# Altium schematic sheet sch.SchDoc
size A4
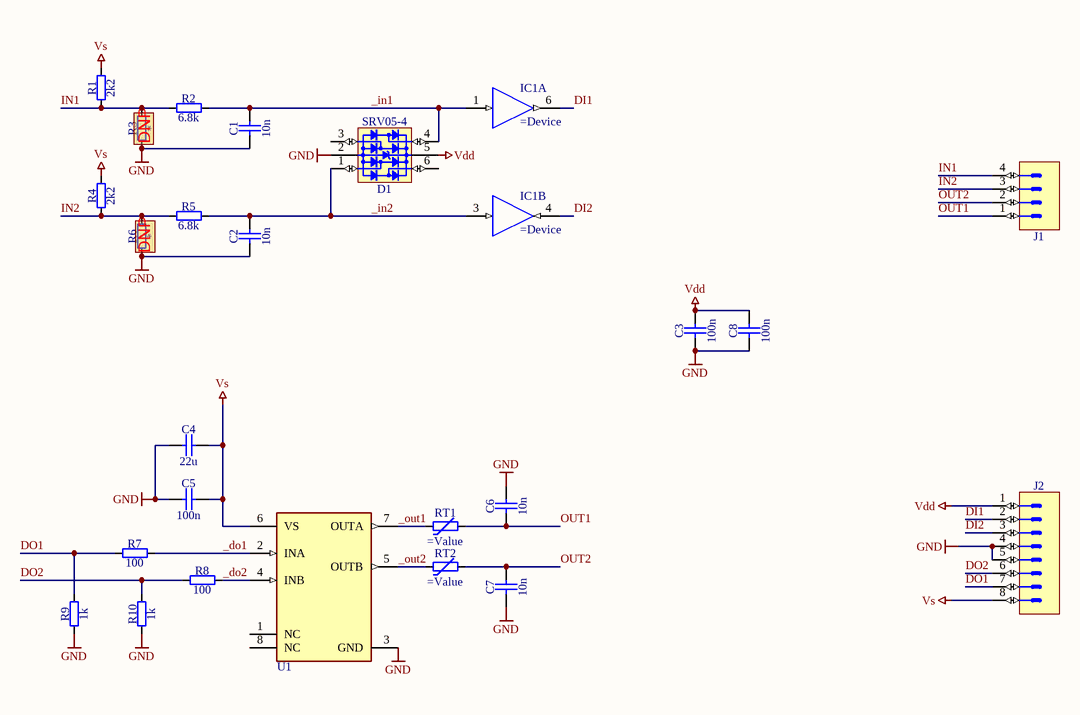
[diagram p0: sch.SchDoc]

## Parts
C1  10n  [CAPC1608X85N]
C2  10n  [CAPC1608X85N]
C3  100n  [CAPC1608X85N]
C4  22u  [CAPC3216X140N]
C5  100n  [CAPC1608X85N]
C6  10n  [CAPC1608X85N]
C7  10n  [CAPC1608X85N]
C8  100n  [CAPC1608X85N]
D1  SRV05-4  [SOT95P280X110-6N]
IC1  (no value)  [SOT65P220X110-6N]  (parts A,B of 2)
J1  (no value)  [MOLEX_22-27-2041]
J2  (no value)  [MOLEX_22-27-2081]
R1  2k2  [RESC3116X65N]
R2  6.8k  [RESC3116X65N]
R3  *  [RESC1608X55N]
R4  2k2  [RESC3116X65N]
R5  6.8k  [RESC3116X65N]
R6  *  [RESC1608X55N]
R7  100  [RESC1608X55N]
R8  100  [RESC1608X55N]
R9  1k  [RESC1608X55N]
R10  1k  [RESC1608X55N]
RT1  (no value)  [FUSC_LITTELFUSE_466]
RT2  (no value)  [FUSC_LITTELFUSE_466]
U1  IR4427STRPBF  [SOIC127P600X175-8N]  (value not drawn)

## Nets
GND: C1.1 C2.1 C3.1 C4.1 C5.1 C6.2 C7.1 C8.1 D1.2(GND) IC1.2(GND) J2.4 J2.5 R3.1 R6.1 R9.1 R10.1 U1.3(GND)
Vdd: C3.2 C8.2 D1.5(VBUS) IC1.5(Vdd) J2.1
Vs: C4.2 C5.2 J2.8 R1.2 R4.2 U1.6(VS)
_do1: R7.2 U1.2(INA)
_do2: R8.2 U1.4(INB)
_in1: C1.2 D1.4(I/O3) IC1.1(IN) R2.2
_in2: C2.2 D1.1(I/O1) IC1.3(IN) R5.2
_out1: RT1.1 U1.7(OUTA)
_out2: RT2.1 U1.5(OUTB)
DI1: IC1.6(OUT) J2.2
DI2: IC1.4(OUT) J2.3
DO1: J2.7 R7.1 R9.2
DO2: J2.6 R8.1 R10.2
IN1: J1.4 R1.1 R2.1 R3.2
IN2: J1.3 R4.1 R5.1 R6.2
OUT1: C6.1 J1.1 RT1.2
OUT2: C7.2 J1.2 RT2.2

Not connected (* = marked no-connect by the designer): D1 3(I/O2) 6(I/O4); U1 1(NC) 8(NC)

## Notes on the sheet
- (near R3) DNP
- (near R6) DNP

## Library data of the parts
C1-C8 = Capacitor - non polarized: Non-polarised capacitor
  C1 C2 C6 C7: Value: 10n
  C3 C5 C8: Value: 100n
  C4: Value: 22u
D1 = SRV05-4: RailClamps Low Capacitance TVS Diode Array; Device: SRV05-4
IC1 = 742G17: Dual Schmitt-Trigger Buffer
J1 = Connector 4 Male
J2 = Connector 8 Male
R1-R10 = Resistor
  R1 R4: Value: 2k2
  R2 R5: Value: 6.8k
  R3 R6: Value: *
  R7 R8: Value: 100
  R9 R10: Value: 1k
RT1 RT2 = Thermistor PTC: Thermistor NTC (Positive Temperature Coefficient)